# EAGLE design munia (EAGLE 8.2.2)

## Sheet 1 of 5: MCU
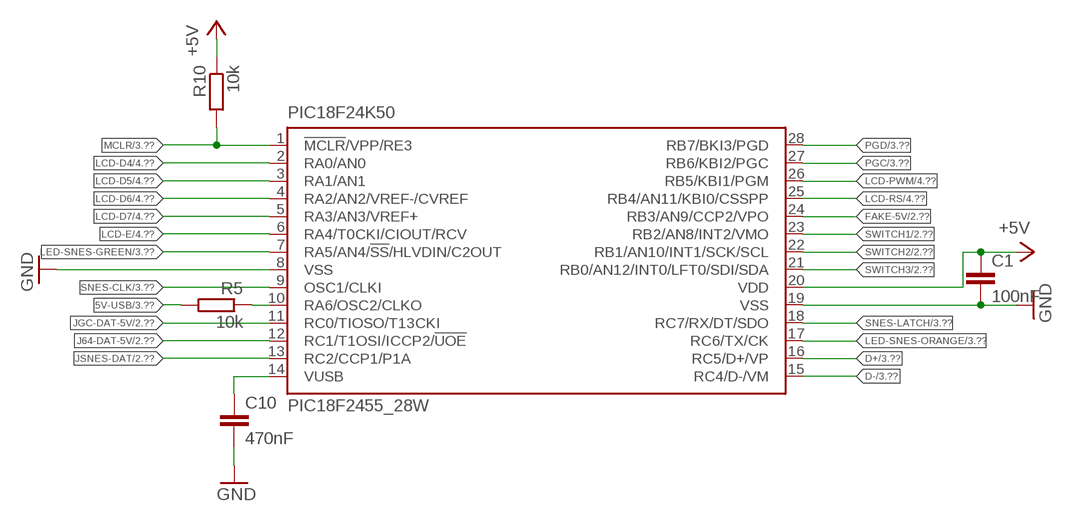
[diagram p0: schematic, sheet 1]

### Parts
C1  100nF  C-EUC0603  [C0603]
C10  470nF  C-EUC0603  [C0603]
PIC18F24K50  PIC18F2455_28W  [SO28W]
R5  10k  R-EU_R0603  [R0603]
R10  10k  R-EU_R0603  [R0603]

### Nets
5V-USB: R5.2 ; also sheet 3,5
+5V: C1.1 PIC18F24K50.20(VDD) R10.1 ; also sheet 2,3,4,5
D+: PIC18F24K50.16(RC5/D+/VP) ; also sheet 3
D-: PIC18F24K50.15(RC4/D-/VM) ; also sheet 3
FAKE-5V: PIC18F24K50.24(RB3/AN9/CCP2/VPO) ; also sheet 2
GND: C1.2 C10.2 PIC18F24K50.8(VSS) PIC18F24K50.19(VSS) ; also sheet 2,3,4,5
J64-DAT-5V: PIC18F24K50.12(RC1/T1OSI/ICCP2/!UOE) ; also sheet 2
JGC-DAT-5V: PIC18F24K50.11(RC0/TIOSO/T13CKI) ; also sheet 2
JSNES-DAT: PIC18F24K50.13(RC2/CCP1/P1A) ; also sheet 2,3
LCD-D4: PIC18F24K50.2(RA0/AN0) ; also sheet 4
LCD-D5: PIC18F24K50.3(RA1/AN1) ; also sheet 4
LCD-D6: PIC18F24K50.4(RA2/AN2/VREF-/CVREF) ; also sheet 4
LCD-D7: PIC18F24K50.5(RA3/AN3/VREF+) ; also sheet 4
LCD-E: PIC18F24K50.6(RA4/T0CKI/CIOUT/RCV) ; also sheet 4
LCD-PWM: PIC18F24K50.26(RB5/KBI1/PGM) ; also sheet 4
LCD-RS: PIC18F24K50.25(RB4/AN11/KBI0/CSSPP) ; also sheet 4
LED-SNES-GREEN: PIC18F24K50.7(RA5/AN4/!SS!/HLVDIN/C2OUT) ; also sheet 3
LED-SNES-ORANGE: PIC18F24K50.17(RC6/TX/CK) ; also sheet 3
MCLR: PIC18F24K50.1(!MCLR!/VPP/RE3) R10.2 ; also sheet 3
N$1: C10.1 PIC18F24K50.14(VUSB)
PGC: PIC18F24K50.27(RB6/KBI2/PGC) ; also sheet 3
PGD: PIC18F24K50.28(RB7/BKI3/PGD) ; also sheet 3
SNES-CLK: PIC18F24K50.9(OSC1/CLKI) ; also sheet 3
SNES-LATCH: PIC18F24K50.18(RC7/RX/DT/SDO) ; also sheet 3
SWITCH1: PIC18F24K50.23(RB2/AN8/INT2/VMO) ; also sheet 2
SWITCH2: PIC18F24K50.22(RB1/AN10/INT1/SCK/SCL) ; also sheet 2
SWITCH3: PIC18F24K50.21(RB0/AN12/INT0/LFT0/SDI/SDA) ; also sheet 2
USB-SENSE: PIC18F24K50.10(RA6/OSC2/CLKO) R5.1

## Sheet 2 of 5: SIGNALS
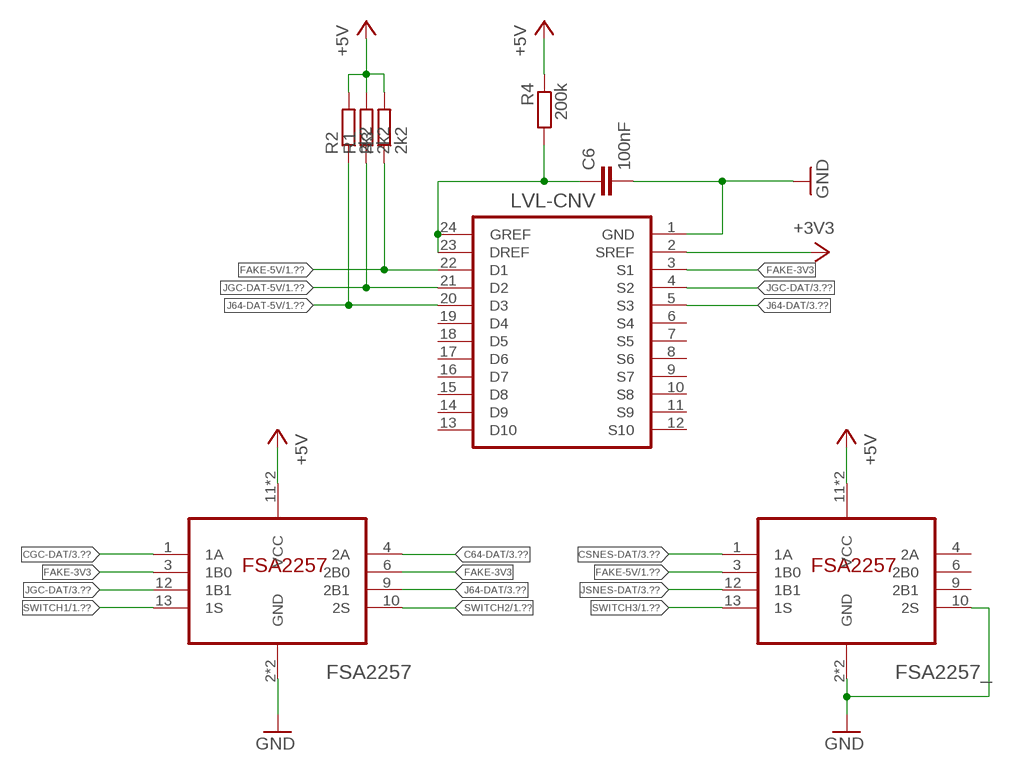
[diagram p1: schematic, sheet 2]

### Parts
C6  100nF  C-EUC0603  [C0603]
FSA2257  FSA2257MTCX  [TSSOP14]
FSA2257_  FSA2257MTCX  [TSSOP14]
LVL-CNV  GTL2010  [TSSOP24]
R1  2k2  R-EU_R0603  [R0603]
R2  2k2  R-EU_R0603  [R0603]
R3  2k2  R-EU_R0603  [R0603]
R4  200k  R-EU_R0603  [R0603]

### Nets
+3V3: LVL-CNV.2(SREF) ; also sheet 3,5
+5V: FSA2257.11(VCC) FSA2257.14(VCC) FSA2257_.11(VCC) FSA2257_.14(VCC) R1.2 R2.2 R3.2 R4.1 ; also sheet 1,3,4,5
C64-DAT: FSA2257.4(2A) ; also sheet 3
CGC-DAT: FSA2257.1(1A) ; also sheet 3
CSNES-DAT: FSA2257_.1(1A) ; also sheet 3
FAKE-3V3: FSA2257.3(1B0) FSA2257.6(2B0) LVL-CNV.3(S1)
FAKE-5V: FSA2257_.3(1B0) LVL-CNV.22(D1) R3.1 ; also sheet 1
GND: C6.2 FSA2257.2(GND) FSA2257.5(GND) FSA2257_.2(GND) FSA2257_.5(GND) FSA2257_.10(2S) LVL-CNV.1(GND) ; also sheet 1,3,4,5
J64-DAT: FSA2257.9(2B1) LVL-CNV.5(S3) ; also sheet 3
J64-DAT-5V: LVL-CNV.20(D3) R2.1 ; also sheet 1
JGC-DAT: FSA2257.12(1B1) LVL-CNV.4(S2) ; also sheet 3
JGC-DAT-5V: LVL-CNV.21(D2) R1.1 ; also sheet 1
JSNES-DAT: FSA2257_.12(1B1) ; also sheet 1,3
N$20: C6.1 LVL-CNV.23(DREF) LVL-CNV.24(GREF) R4.2
SWITCH1: FSA2257.13(1S) ; also sheet 1
SWITCH2: FSA2257.10(2S) ; also sheet 1
SWITCH3: FSA2257_.13(1S) ; also sheet 1
Unconnected: FSA2257_.4(2A) FSA2257_.6(2B0) FSA2257_.9(2B1) LVL-CNV.6(S4) LVL-CNV.7(S5) LVL-CNV.8(S6) LVL-CNV.9(S7) LVL-CNV.10(S8) LVL-CNV.11(S9) LVL-CNV.12(S10) LVL-CNV.13(D10) LVL-CNV.14(D9) LVL-CNV.15(D8) LVL-CNV.16(D7) LVL-CNV.17(D6) LVL-CNV.18(D5) LVL-CNV.19(D4)

## Sheet 3 of 5: CONNECTORS
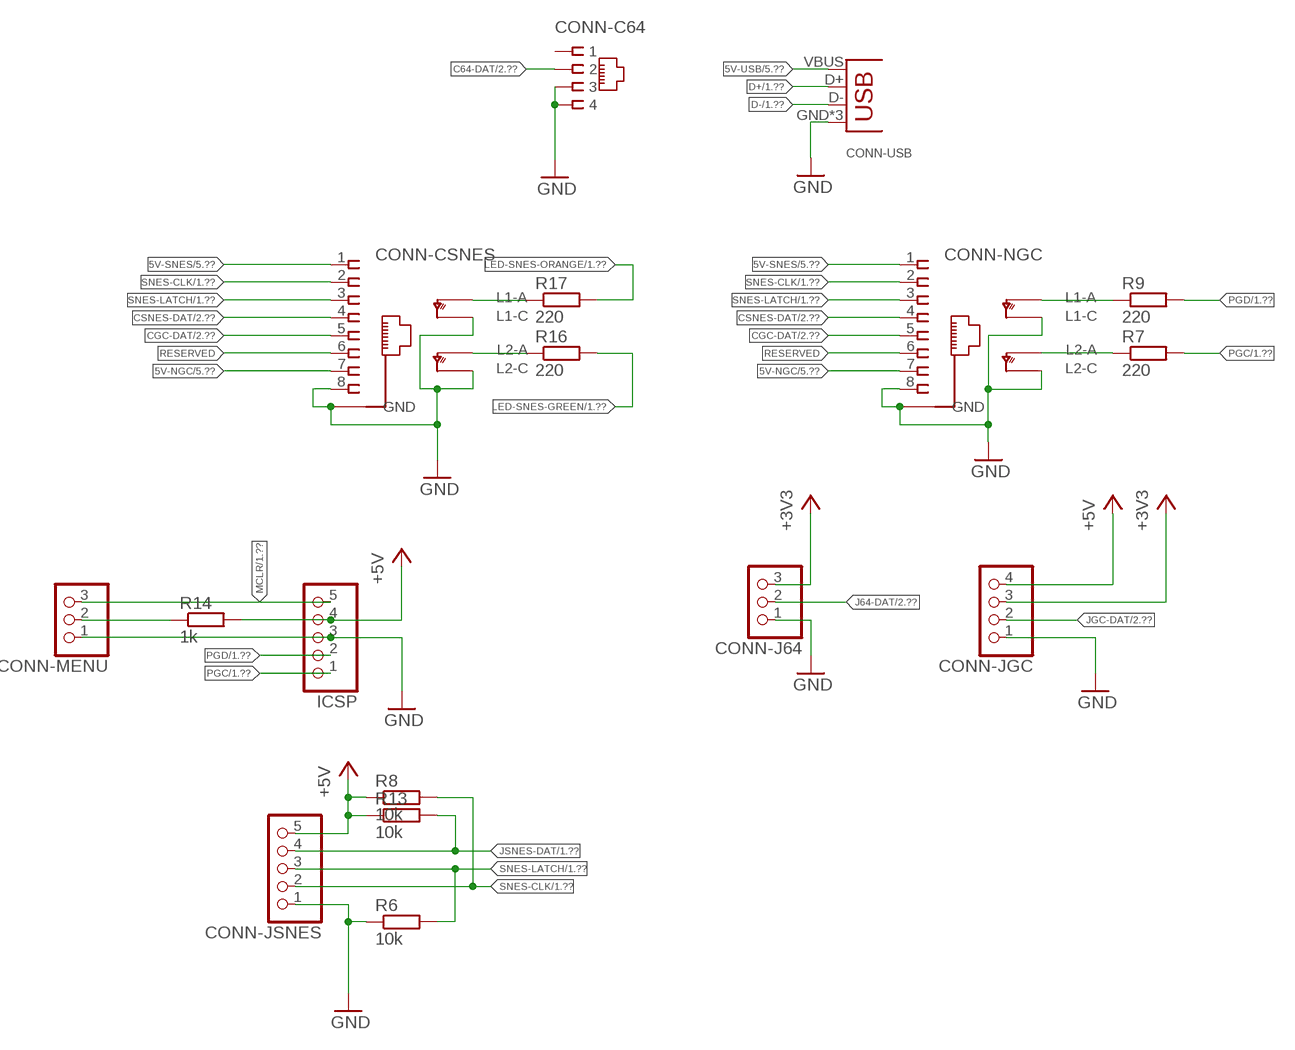
[diagram p2: schematic, sheet 3]

### Parts
CONN-C64  RJ11-6P4C  [RJ11-4C]
CONN-CSNES  RJ45-NIELS  [RJ45-NIELS]
CONN-J64  PINHD-1X3  [1X03]
CONN-JGC  PINHD-1X4  [1X04]
CONN-JSNES  PINHD-1X5  [1X05]
CONN-MENU  PINHD-1X3  [1X03]
CONN-NGC  RJ45-NIELS  [RJ45-NIELS]
CONN-USB  USB-B-NIELS  [USB-B-H]
ICSP  PINHD-1X5  [1X05]
R6  10k  R-EU_R0603  [R0603]
R7  220  R-EU_R0603  [R0603]
R8  10k  R-EU_R0603  [R0603]
R9  220  R-EU_R0603  [R0603]
R13  10k  R-EU_R0603  [R0603]
R14  1k  R-EU_R0603  [R0603]
R16  220  R-EU_R0603  [R0603]
R17  220  R-EU_R0603  [R0603]

### Nets
5V-NGC: CONN-CSNES.7 CONN-NGC.7 ; also sheet 5
5V-SNES: CONN-CSNES.1 CONN-NGC.1 ; also sheet 5
5V-USB: CONN-USB.VBUS ; also sheet 1,5
+3V3: CONN-J64.3 CONN-JGC.3 ; also sheet 2,5
+5V: CONN-JGC.4 CONN-JSNES.5 ICSP.4 R8.1 R13.1 R14.2 ; also sheet 1,2,4,5
C64-DAT: CONN-C64.2 ; also sheet 2
CGC-DAT: CONN-CSNES.5 CONN-NGC.5 ; also sheet 2
CSNES-DAT: CONN-CSNES.4 CONN-NGC.4 ; also sheet 2
D+: CONN-USB.D+ ; also sheet 1
D-: CONN-USB.D- ; also sheet 1
GND: CONN-C64.3 CONN-C64.4 CONN-CSNES.8 CONN-CSNES.GND@5(GND) CONN-CSNES.GND@6(GND) CONN-CSNES.LED-GREEN-C(L2C) CONN-CSNES.LED-ORANGE-C(L1C) CONN-J64.1 CONN-JGC.1 CONN-JSNES.1 CONN-MENU.1 CONN-NGC.8 CONN-NGC.GND@5(GND) CONN-NGC.GND@6(GND) CONN-NGC.LED-GREEN-C(L2C) CONN-NGC.LED-ORANGE-C(L1C) CONN-USB.GND CONN-USB.GND@1(GND) CONN-USB.GND@2(GND) ICSP.3 R6.1 ; also sheet 1,2,4,5
J64-DAT: CONN-J64.2 ; also sheet 2
JGC-DAT: CONN-JGC.2 ; also sheet 2
JSNES-DAT: CONN-JSNES.4 R13.2 ; also sheet 1,2
LED-SNES-GREEN: R16.2 ; also sheet 1
LED-SNES-ORANGE: R17.2 ; also sheet 1
MCLR: CONN-MENU.3 ICSP.5 ; also sheet 1
N$4: CONN-CSNES.LED-ORANGE-A(L1A) R17.1
N$5: CONN-CSNES.LED-GREEN-A(L2A) R16.1
N$8: CONN-NGC.LED-ORANGE-A(L1A) R9.1
N$23: CONN-NGC.LED-GREEN-A(L2A) R7.1
PGC: ICSP.1 R7.2 ; also sheet 1
PGD: ICSP.2 R9.2 ; also sheet 1
PWR-LED: CONN-MENU.2 R14.1
RESERVED: CONN-CSNES.6 CONN-NGC.6
SNES-CLK: CONN-CSNES.2 CONN-JSNES.2 CONN-NGC.2 R8.2 ; also sheet 1
SNES-LATCH: CONN-CSNES.3 CONN-JSNES.3 CONN-NGC.3 R6.2 ; also sheet 1
Unconnected: CONN-C64.1

## Sheet 4 of 5: LCD
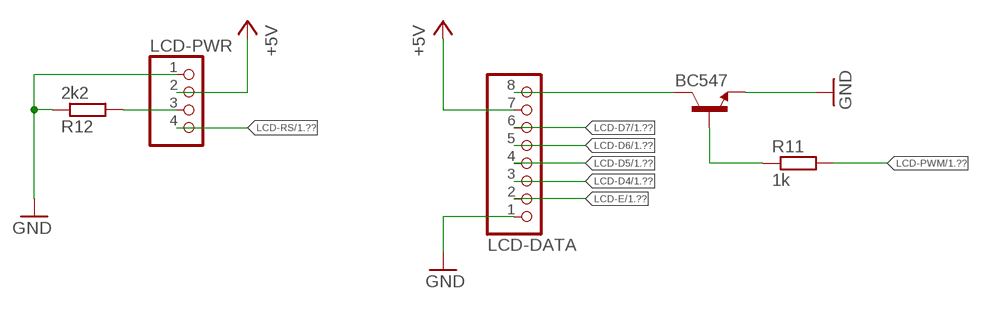
[diagram p3: schematic, sheet 4]

### Parts
BC547  BC847  [SOT23]
LCD-DATA  PINHD-1X8  [1X08]
LCD-PWR  PINHD-1X4  [1X04]
R11  1k  R-EU_R0603  [R0603]
R12  2k2  R-EU_R0603  [R0603]

### Nets
+5V: LCD-DATA.7 LCD-PWR.2 ; also sheet 1,2,3,5
C: BC547.3(C) LCD-DATA.8
GND: BC547.2(E) LCD-DATA.1 LCD-PWR.1 R12.1 ; also sheet 1,2,3,5
LCD-D4: LCD-DATA.3 ; also sheet 1
LCD-D5: LCD-DATA.4 ; also sheet 1
LCD-D6: LCD-DATA.5 ; also sheet 1
LCD-D7: LCD-DATA.6 ; also sheet 1
LCD-E: LCD-DATA.2 ; also sheet 1
LCD-PWM: R11.2 ; also sheet 1
LCD-RS: LCD-PWR.4 ; also sheet 1
N$19: BC547.1(B) R11.1
VEE: LCD-PWR.3 R12.2

## Sheet 5 of 5: POWER
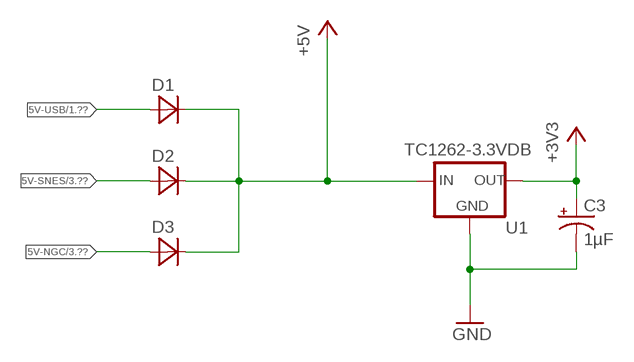
[diagram p4: schematic, sheet 5]

### Parts
C3  1µF  TANT-CAP1206  [EIA3216]
D1  MBR120VLSFT1G  [SOD123]
D2  MBR120VLSFT1G  [SOD123]
D3  MBR120VLSFT1G  [SOD123]
U1  TC1262-3.3VDB  [SOT230P700X180-4N]

### Nets
5V-NGC: D3.2(A) ; also sheet 3
5V-SNES: D2.2(A) ; also sheet 3
5V-USB: D1.2(A) ; also sheet 1,3
+3V3: C3.A(+) U1.3(OUT) ; also sheet 2,3
+5V: D1.1(C) D2.1(C) D3.1(C) U1.1(IN) ; also sheet 1,2,3,4
GND: C3.C(-) U1.2(GND) U1.4(GND) ; also sheet 1,2,3,4

## Library data of the parts
BC547 = transistor-neu-to92:BC847: NPN TRANSISTOR
C1 C6 C10 = resistor:C-EU: CAPACITOR, European symbol
C3 = Spark:TANT-CAP: Tantalum SMT
CONN-C64 = frank:RJ11-6P4C
CONN-CSNES CONN-NGC = frank:RJ45-NIELS
CONN-J64 CONN-MENU = pinhead:PINHD-1X3: PIN HEADER
CONN-JGC LCD-PWR = pinhead:PINHD-1X4: PIN HEADER
CONN-JSNES ICSP = pinhead:PINHD-1X5: PIN HEADER
CONN-USB = frank:USB: USB Connectors
D1-D3 = frank:MBR120VLSFT1G: DIODE, SCHOTTKY, 1A, 20V, SOD-123FL
FSA2257 FSA2257_ = frank:FSA2257MTCX
LCD-DATA = pinhead:PINHD-1X8: PIN HEADER
LVL-CNV = frank:GTL2010
PIC18F24K50 = microchip:PIC18F2*_28: USB Microcontrollers with nanoWatt Technology High-Performance, Enhanced Flash, 28/40/44-Pin, Source: http://ww1.microchip.com/downloads/en/devicedoc/39632c.pdf; MF: MICROCHIP; MPN: PIC18F2455-I/SO; OC_FARNELL: 1579598; OC_NEWARK: 64J3768
R1-R14 R16 R17 = resistor:R-EU_: RESISTOR, European symbol
U1 = frank:TC1262-3.3VDB: IC, 500mA Fixed Output CMOS LDO,3.3V,SOT-223, 3-lead; MPN: TC1262-3.3VDB; OC_FARNELL: 1852183; OC_NEWARK: 53R0370; PACKAGE: SOT-223-3; SUPPLIER: Microchip

## Net classes
0 default: width 0.152 mm, drill 0.25 mm, clearance 0.152 mm

## Board
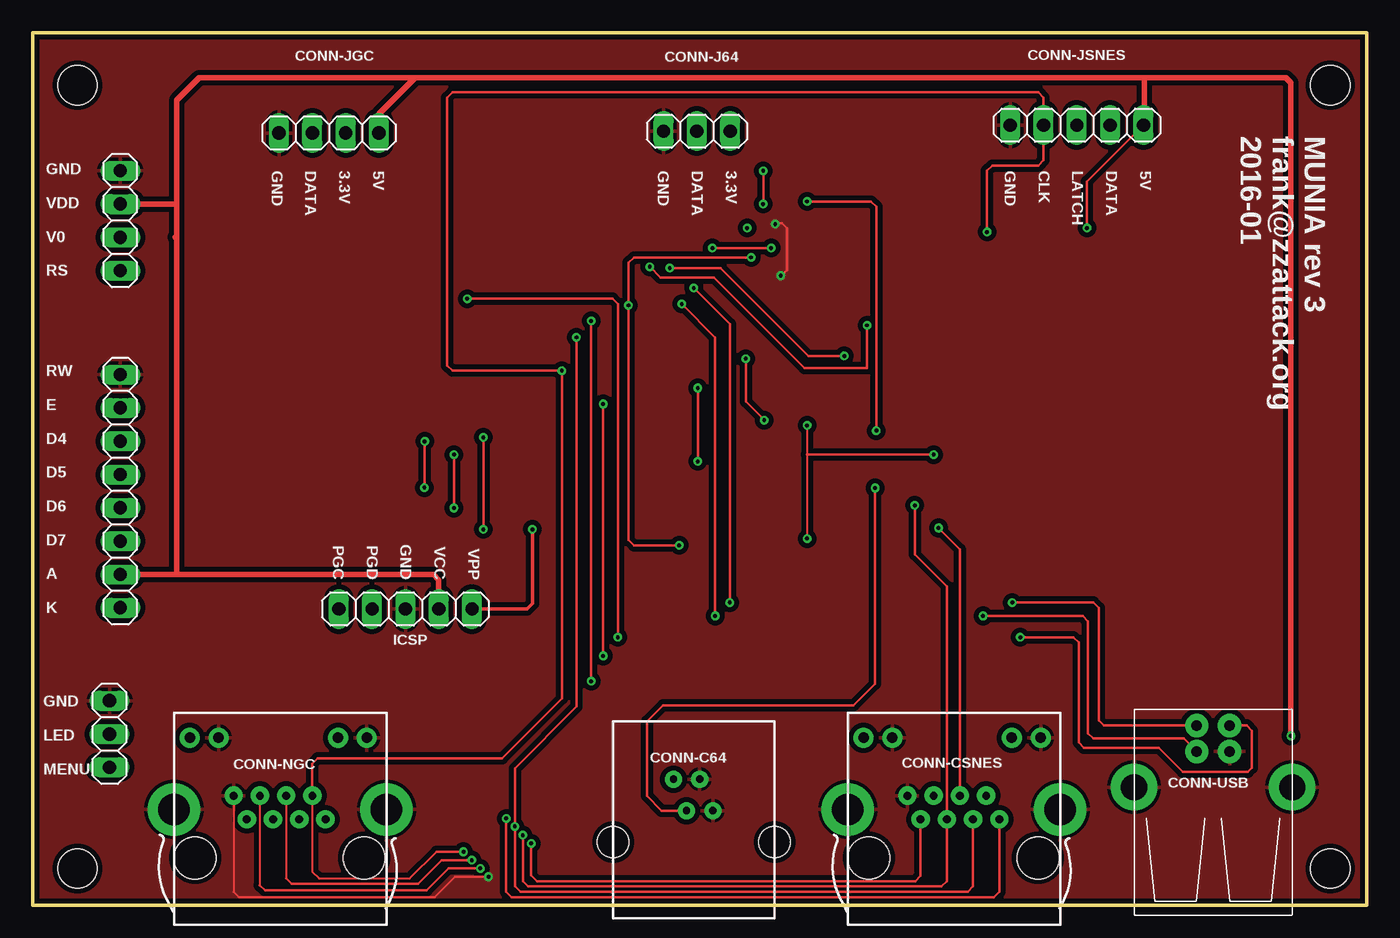
[diagram p5: board, top side]
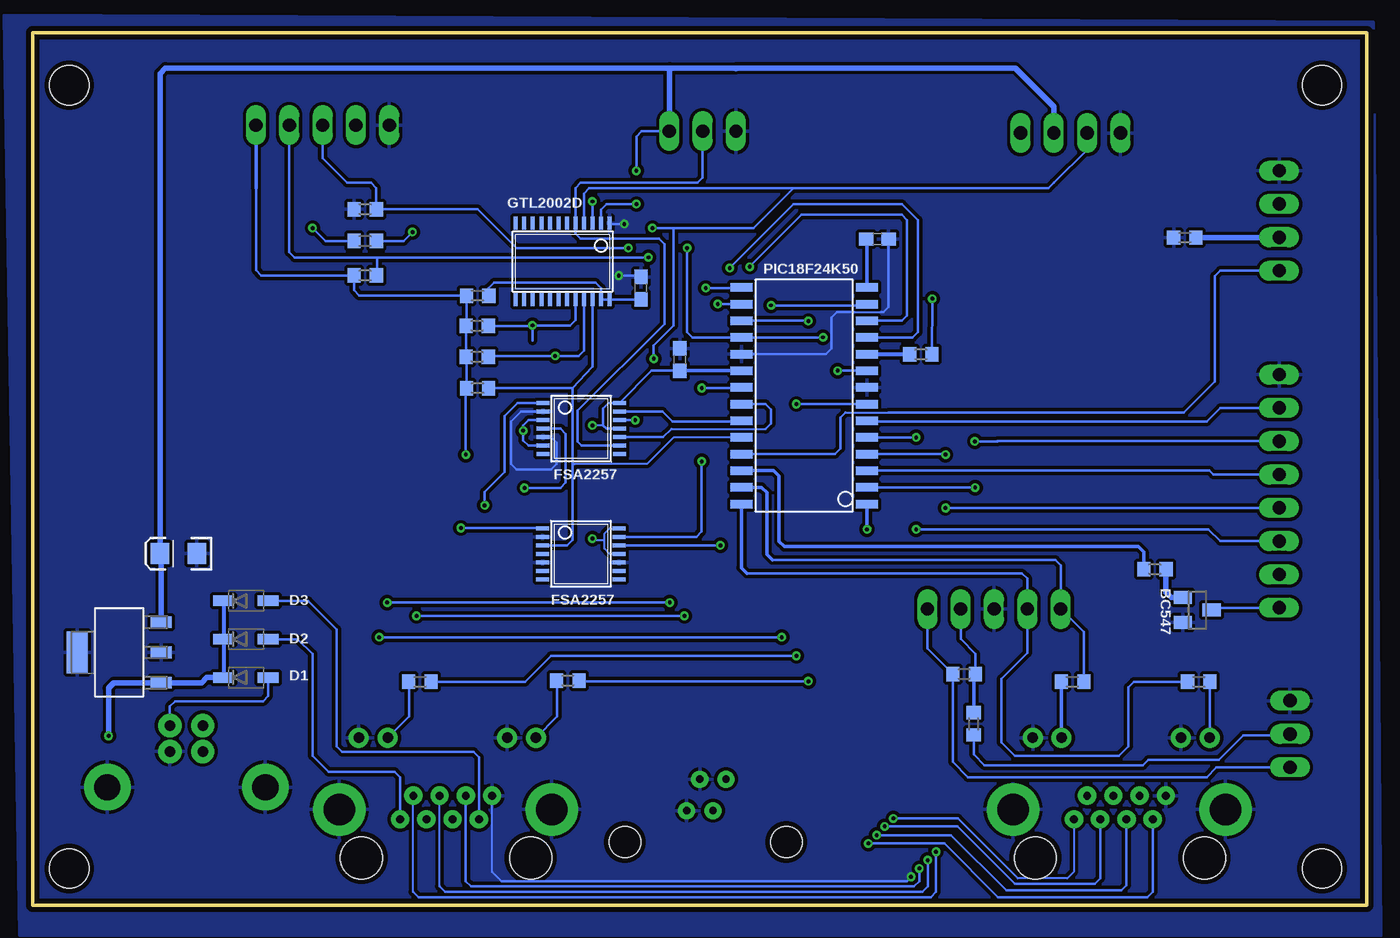
[diagram p6: board, bottom side, seen from below]

Size 101.67 x 66.5 mm. Coordinates in mm from the lower left corner, seen from the top.
Outline: 101.67,0 0,0 0,66.5 101.67,66.5 101.67,0
Copper layers (1*16): Top 0.0356mm / dielectric 1.5011mm / Bottom 0.0356mm
Design rules "pcbway 6mil 0.3mm drills *": minimum track width 6mil, minimum drill 0.3mm, track to track 6mil, track to pad 6mil, pad to pad 6mil, via to via 6mil, smd to smd 6mil, copper to edge 15mil, drill to drill 6mil, minimum pad ring 7mil, minimum via ring 7mil, stop-mask expansion 4mil, vias tented up to drill 999mil, thermal gap 10mil
Holes 3 mm at 3.4,62.5 3.4,2.77 98.9,62.5 98.9,2.77

### Footprints (pad centres in the part's own frame; a part is rotated, then mirrored left to right if it is on the bottom)
SOT23 = smd 1 x 1.4: 1 -0.95,-1.1; 2 0.95,-1.1; 3 0,1.1
C0603 = smd 1.1 x 1: 1 -0.85,0; 2 0.85,0
EIA3216 = smd 1.4 x 1.6: A 1.4,0; C -1.4,0
RJ11-4C = drill 0.55 pad 1.3: 1 4.6,10.6; 2 5.6,8.2; 3 6.6,10.6; 4 7.6,8.2 | hole 2.4: 0,5.8; 12.3,5.8
RJ45-NIELS = drill 0.6 pad 1.397: 1 11.55,8.05; 2 10.55,9.85; 3 9.55,8.05; 4 8.55,9.85; 5 7.55,8.05; 6 6.55,9.85; 7 5.55,8.05; 8 4.55,9.85 | drill 2.4 pad 4: GND@5 0,8.8; GND@6 16.2,8.8 | drill 0.8 pad 1.524: LED-GREEN-A 12.5,14.26; LED-GREEN-C 14.7,14.26; LED-ORANGE-A 1.2,14.26; LED-ORANGE-C 3.4,14.26 | hole 3.2: 1.6,5.1; 14.5,5.1
1X03 = drill 1.016 long: 1 -2.54,0; 2 0,0; 3 2.54,0
1X04 = drill 1.016 long: 1 -3.81,0; 2 -1.27,0; 3 1.27,0; 4 3.81,0
1X05 = drill 1.016 long: 1 -5.08,0; 2 -2.54,0; 3 0,0; 4 2.54,0; 5 5.08,0
USB-B-H = drill 0.8 pad 1.778: D+ 0,1.25; D- 1.981,1.25; GND 0,-1.25; VBUS 1.981,-1.25 | drill 2 pad 3.556: GND@1 -2.718,-6.02; GND@2 -2.718,6.02
SOD123 = smd 1.6 x 0.8: 1 -1.7,0; 2 1.7,0
TSSOP14 = smd 0.305 x 0.991: 1 -1.95,-2.918; 2 -1.3,-2.918; 3 -0.65,-2.918; 4 0,-2.918; 5 0.65,-2.918; 6 1.3,-2.918; 7 1.95,-2.918; 8 1.95,2.918; 9 1.3,2.918; 10 0.65,2.918; 11 0,2.918; 12 -0.65,2.918; 13 -1.3,2.918; 14 -1.95,2.918
1X08 = drill 1.016 long: 1 -8.89,0; 2 -6.35,0; 3 -3.81,0; 4 -1.27,0; 5 1.27,0; 6 3.81,0; 7 6.35,0; 8 8.89,0
TSSOP24 = smd 0.305 x 0.991: 1 -3.575,-2.918; 2 -2.925,-2.918; 3 -2.275,-2.918; 4 -1.625,-2.918; 5 -0.975,-2.918; 6 -0.325,-2.918; 7 0.325,-2.918; 8 0.975,-2.918; 9 1.625,-2.918; 10 2.275,-2.918; 11 2.925,-2.918; 12 3.575,-2.918; 13 3.575,2.918; 14 2.925,2.918; 15 2.275,2.918; 16 1.625,2.918; 17 0.975,2.918; 18 0.325,2.918; 19 -0.325,2.918; 20 -0.975,2.918; 21 -1.625,2.918; 22 -2.275,2.918; 23 -2.925,2.918; 24 -3.575,2.918
SO28W = smd 0.65 x 1.7: 1 -7.62,-4.78; 2 -6.35,-4.78; 3 -5.08,-4.78; 4 -3.81,-4.78; 5 -2.54,-4.78; 6 -1.27,-4.78; 7 0,-4.78; 8 1.27,-4.78; 9 2.54,-4.78; 10 3.81,-4.78; 11 5.08,-4.78; 12 6.35,-4.78; 13 7.62,-4.78; 14 8.89,-4.78; 15 8.89,4.78; 16 7.62,4.78; 17 6.35,4.78; 18 5.08,4.78; 19 3.81,4.78; 20 2.54,4.78; 21 1.27,4.78; 22 0,4.78; 23 -1.27,4.78; 24 -2.54,4.78; 25 -3.81,4.78; 26 -5.08,4.78; 27 -6.35,4.78; 28 -7.62,4.78
R0603 = smd 1 x 1.1: 1 -0.85,0; 2 0.85,0
SOT230P700X180-4N = smd 1.626 x 0.889: 1 -3.2,2.311; 2 -3.2,0; 3 -3.2,-2.311 | smd 1.626 x 3.175: 4 3.2,0

### Placement (x,y rotation side)
BC547  12.91,22.49 270 bottom
C1  52.36,41.58 90 bottom
C3  90.57,26.8 180 bottom
C6  55.32,47.03 90 bottom
C10  37.29,50.78 0 bottom
CONN-C64  44.24,-1 0 top
CONN-CSNES  62.12,-1.51 0 top
CONN-J64  50.62,59 0 top
CONN-JGC  22.58,58.86 0 top
CONN-JSNES  79.58,59.46 0 top
CONN-MENU  5.86,13.04 270 top
CONN-NGC  10.76,-1.51 0 top
CONN-USB  89.97,11.7 90 top
D1  85.42,17.35 0 bottom
D2  85.42,20.27 0 bottom
D3  85.42,23.19 0 bottom
FSA2257  59.88,36.32 270 bottom
FSA2257_  59.9,26.78 270 bottom
ICSP  28.4,22.58 0 top
LCD-DATA  6.67,31.55 270 top
LCD-PWR  6.67,52.17 270 top
LVL-CNV  61.29,49.06 180 bottom
PIC18F24K50  42.88,38.19 90 bottom
R1  67.8,41.8 180 bottom
R2  67.8,44.15 180 bottom
R3  67.77,39.41 180 bottom
R4  67.77,46.46 0 bottom
R5  33.99,41.98 0 bottom
R6  76.34,53.05 0 bottom
R7  22.42,17.02 0 bottom
R8  76.34,50.62 0 bottom
R9  12.8,17.02 180 bottom
R10  30.68,17.61 180 bottom
R11  16.14,25.61 180 bottom
R12  13.87,50.88 0 bottom
R13  76.34,48 0 bottom
R14  29.96,13.82 90 bottom
R16  72.17,17.02 0 bottom
R17  60.89,17.12 0 bottom
U1  95.08,19.27 180 bottom

### Tracks (layer width: path | path; a pad name or v marks a point on that pad's centre or on a via)
5V-NGC  (via drill 0.3)
  Top 0.203: CONN-CSNES.7 67.67,2.23 67.26,1.83 38.42,1.83 37.99,2.26 v37.99,4.7
  Bottom 0.203: CONN-NGC.7 16.31,1.02 16.72,0.61 28.11,0.61 32.19,4.7 v37.99,4.7 | 83.71,23.16 D3.2 80.67,23.19 78.51,21.03 78.51,12.09 78.1,11.68 68.08,11.68 67.67,11.28 CONN-CSNES.7
5V-SNES  (via drill 0.3)
  Top 0.203: v36.08,6.6 36.08,1.02 36.49,0.61 73.26,0.61 73.67,1.02 CONN-CSNES.1
  Bottom 0.152: CONN-NGC.1 22.31,2.54 22.82,2.03 26.61,2.03 31.18,6.6
  Bottom 0.203: v36.08,6.6 31.18,6.6 | D2.2 81.47,20.27 80.35,19.15 80.35,11.38 79.13,10.16 74.08,10.16 73.67,9.75 CONN-CSNES.1
5V-USB  (via drill 0.3)
  Top 0.203: v33.11,46.23 44.18,46.23 44.59,45.82 v44.59,20.42 | CONN-USB.VBUS 92.53,13.68 92.94,13.28 92.94,10.46 92.63,10.16 87.65,10.16 85.82,11.99 80.13,11.99 79.73,12.39 79.73,20.02 79.32,20.42 v75.27,20.42
  Bottom 0.203: R5.2 v33.11,46.23 | v44.59,20.42 v75.27,20.42 | CONN-USB.VBUS 91.22,15.14 90.82,15.54 84.12,15.54 83.72,15.95 D1.2
+3V3  (via drill 0.3, 0.3 pad 0.3)
  Top 0.203: v55.66,53.44 55.68,53.45 v55.68,55.98
  Bottom 0.203: U1.3 92.03,21.73 | 58.41,52.02 LVL-CNV.2 58.36,53.03 57.96,53.44 v55.66,53.44 | v55.68,55.98 55.66,55.99 55.66,58.59 55.26,59 CONN-J64.3
  Bottom 0.406: 48.04,63.8 26.79,63.8 23.85,60.86 CONN-JGC.3 | 48.08,63.77 48.04,63.8 | 92.03,21.73 91.98,21.78 92.02,21.82 | U1.3 91.88,26.7 C3.A 91.97,63.4 91.57,63.8 53.14,63.8 | 53.14,63.8 48.04,63.8 | 53.16,63.78 53.14,63.8 | CONN-J64.3 53.14,59.02 53.14,63.8
+5V  (via drill 0.3)
  Top 0.152: v59.02,36.58 59.02,34.34 v59.02,27.94
  Top 0.203: 59.02,34.34 v68.67,34.34 | v80.35,51.61 80.35,55.15 CONN-JSNES.5 84.72,59.52 | 10.86,53.45 10.96,53.54
  Top 0.406: 29.16,63.09 12.69,63.09 10.96,61.37 10.96,53.54 10.96,50.8 | 29.16,63.09 84.72,63.09 | v95.9,12.9 95.9,62.69 95.49,63.09 84.72,63.09 | 10.96,50.8 10.96,25.3 10.86,25.2 | 10.86,50.91 10.96,50.8 | LCD-DATA.7 10.86,25.2 | LCD-PWR.2 10.86,53.45 | ICSP.4 30.94,24.79 30.54,25.2 10.86,25.2 | 84.72,59.52 84.72,63.09 | CONN-JGC.4 26.39,60.32 29.16,63.09
  Bottom 0.152: FSA2257_.11 57.7,26.78 58.1,27.18 58.1,27.84 | 58.1,27.84 58.1,28.32 57.7,28.73 FSA2257_.14 | 58.2,36.58 v59.02,36.58 | v59.02,27.94 58.91,27.84 58.1,27.84
  Bottom 0.203: U1.1 | FSA2257.11 57.95,36.32 58.2,36.58 58.2,37.86 57.8,38.27 FSA2257.14 54.49,40.73 C1.1 | 68.62,44.18 R2.2 | R2.2 R1.2 68.62,41.57 R3.2 68.67,39.37 v68.67,34.34 | R2.2 68.62,44.19 R4.1 76.78,46.46 77.19,46.87 R13.1 84.25,48 84.66,48.41 84.66,54.67 | R8.1 79.36,50.62 v80.35,51.61 | R10.1 29.83,19.16 30.94,20.27 ICSP.4
  Bottom 0.254: 84.66,54.67 CONN-JSNES.5 | R14.2 29.96,17.48 R10.1 | 47.69,40.71 PIC18F24K50.20 C1.1
  Bottom 0.305: D3.1 87.14,20.29 D2.1 D1.1
  Bottom 0.406: U1.1 95.49,16.96 95.9,16.55 v95.9,12.9 | U1.1 88.8,16.95 88.41,17.35 D1.1
C
  Bottom 0.203: LCD-DATA.8 11.65,22.66 arc-90 BC547.3
C64-DAT  (via drill 0.3)
  Top 0.203: v64.2,31.8 64.2,16.88 62.56,15.24 48.03,15.24 46.81,14.02 46.81,8.33 47.94,7.2 CONN-C64.2
  Bottom 0.203: FSA2257.4 61.45,36.32 61.05,35.91 61.05,32.21 61.45,31.8 v64.2,31.8
CGC-DAT  (via drill 0.3)
  Top 0.203: v37.35,5.33 37.35,1.83 37.76,1.42 69.26,1.42 69.67,1.83 CONN-CSNES.5 69.67,24.28 67.23,26.72 v67.23,30.48
  Bottom 0.203: CONN-NGC.5 18.31,1.52 18.72,1.12 27.47,1.12 31.69,5.33 v37.35,5.33 | FSA2257.1 64.74,38.27 65.72,37.29 65.72,33.01 67.23,31.5 v67.23,30.48
CSNES-DAT  (via drill 0.3)
  Top 0.152: CONN-NGC.4 19.31,2.03
  Top 0.203: 19.31,2.03 19.72,1.63 29.38,1.63 31.18,3.43 v33.46,3.43 | CONN-CSNES.4 70.67,27.13 v69.05,28.75
  Bottom 0.152: 70.67,1.42 CONN-CSNES.4
  Bottom 0.203: v33.46,3.43 33.46,1.42 33.87,1.02 70.26,1.02 70.67,1.42 | FSA2257_.1 62.84,28.75 v69.05,28.75
D+  (via drill 0.3)
  Top 0.203: v49.47,45.82 52.01,43.28 v52.01,22.05 | v72.43,22.05 80.03,22.05 80.44,21.64 80.44,13.11 80.84,12.7 87.72,12.7 CONN-USB.D+
  Bottom 0.203: v72.43,22.05 v52.01,22.05 | PIC18F24K50.16 47.67,45.82 v49.47,45.82
D-  (via drill 0.3)
  Top 0.203: v53.12,23.06 53.12,44.3 v50.38,47.04 | CONN-USB.D- 81.66,13.68 81.25,14.09 81.25,22.66 80.84,23.06 v74.66,23.06
  Bottom 0.203: v74.66,23.06 v53.12,23.06 | v50.38,47.04 47.7,47.04 PIC18F24K50.15
FAKE-3V3  (via drill 0.3)
  Top 0.203: v64.3,36.17 64.3,53.24 63.89,53.65 v59.02,53.65
  Bottom 0.203: v59.02,53.65 LVL-CNV.3 | FSA2257.6 63.89,35.02 64.3,35.43 v64.3,36.17 64.3,36.56 63.89,36.97 FSA2257.3
FAKE-5V
  Bottom 0.152: PIC18F24K50.24 52.83,35.65 54.85,33.63 60.37,33.63
  Bottom 0.203: 64.61,39.42 64.1,39.42 | 64.1,39.42 60.54,39.42 | FSA2257_.3 60.95,27.43 60.54,27.83 60.54,33.63 | 60.54,33.63 60.54,39.42 | 60.37,33.63 60.54,33.63 | R3.1 64.11,39.41 64.1,39.42 | LVL-CNV.22 59.01,41.05 60.54,39.42
GND  (via drill 0.3, 0.3 pad 0.3)
  Top 0.152: CONN-NGC.8 15.31,1.02
  Top 0.203: 15.31,1.02 15.72,0.61 30.64,0.61 32.19,2.16 v34.73,2.16 | v57.01,47.99 57.09,47.99 57.5,48.4 57.5,51.59 57.09,52 56.5,52
  Bottom 0.152: 66.67,2.54 CONN-CSNES.8 | 39.05,45.19 36.98,45.19 | 36.51,50.64 C10.2 | 47.62,42.07 PIC18F24K50.19 | 55.5,48 C6.2
  Bottom 0.203: 55.41,47.94 C6.2 | 66.67,2.54 65.96,1.83 35.06,1.83 v34.73,2.16 | FSA2257.5 62.17,35.67 61.76,35.26 61.76,33.63 62.17,33.22 64.81,33.22 65.21,33.63 65.21,36.88 64.47,37.62 FSA2257.2 | PIC18F24K50.19 41.2,42 40.8,42.41 40.8,44.79 40.39,45.19 39.05,45.19 | C10.2 36.44,45.6 36.85,45.19 36.98,45.19 | LVL-CNV.1 57.65,51.92 v56.59,51.92 | 55.5,48 55.51,47.99 v57.01,47.99
  pour Bottom (isolate 0.254): -1.09,-2.34 -0.49,67.31 103.86,67.83 102.66,-2.3
  pour Top (isolate 0.381): -0.97,-0.92 -1.27,69.04 105.42,68.42 103.76,-1.76
J64-DAT
  Bottom 0.152: 56.93,35.05 FSA2257.9
  Bottom 0.203: CONN-J64.2 50.62,55.47 51.03,55.07 59.91,55.07 60.31,54.66 LVL-CNV.5 60.31,51.21 59.91,50.8 53.94,50.8 53.53,50.39 53.53,44.3 60.13,37.69 60.13,35.36 59.83,35.05 56.93,35.05
J64-DAT-5V  (via drill 0.3)
  Top 0.203: v47.03,48.67 47.84,47.85 51.91,47.85 58.81,40.95 63.59,40.95 v63.59,44.2
  Bottom 0.203: PIC18F24K50.12 35.45,44.54 35.04,44.95 35.04,52.22 35.45,52.63 43.07,52.63 v47.03,48.67 | v63.59,44.2 63.59,43.04 | LVL-CNV.20 60.31,44.6 60.72,44.2 v63.59,44.2 | v63.59,44.2 63.63,44.15 R2.1
JGC-DAT  (via drill 0.3)
  Top 0.203: v55.75,36.97 54.34,38.38 v54.34,41.66
  Bottom 0.152: 23.85,55.07 21.31,57.61 CONN-JGC.2
  Bottom 0.203: LVL-CNV.4 59.66,54.25 59.26,54.66 43.69,54.66 | FSA2257.12 v55.75,36.97 | v54.34,41.66 54.34,42.67 52.82,44.2 52.82,51.21 52.83,51.22 52.83,51.61 | 53.23,51.61 v54.45,51.61 52.83,51.61 | 52.83,51.61 46.74,51.61 43.69,54.66 | 23.85,55.07 24.25,54.66 43.69,54.66
JGC-DAT-5V  (via drill 0.3)
  Top 0.203: v48.55,48.56 52.41,48.56 59.12,41.86 v61.86,41.86
  Bottom 0.203: LVL-CNV.21 59.66,42.27 60.07,41.86 v61.86,41.86 66.89,41.86 R1.1 | PIC18F24K50.11 34.63,43.27 34.23,43.68 34.23,52.22 35.45,53.44 43.67,53.44 v48.55,48.56
JSNES-DAT  (via drill 0.3)
  Top 0.203: v49.26,27.43 45.81,27.43 45.4,27.84 v45.4,45.72 45.4,48.97 45.81,49.38 v54.75,49.38
  Bottom 0.203: CONN-JSNES.4 82.12,49.78 81.71,49.38 75.43,49.38 | FSA2257_.12 v49.26,27.43 | v45.4,45.72 38.19,45.72 PIC18F24K50.13 | 75.43,49.38 v54.75,49.38 | R13.2 75.43,48.06 75.43,49.38
LCD-D4  (via drill 0.3)
  Top 0.203: v29.84,31.83 29.87,31.85 v29.87,35.36
  Bottom 0.203: LCD-DATA.3 28.13,35.36 28.14,35.36 v29.87,35.36 | v29.84,31.83 29.86,31.84 PIC18F24K50.2
LCD-D5
  Bottom 0.203: LCD-DATA.4 11.69,32.82 11.98,33.11 PIC18F24K50.3
LCD-D6  (via drill 0.3)
  Top 0.203: v32.11,34.34 v32.11,30.28
  Bottom 0.203: LCD-DATA.5 25.59,30.28 v32.11,30.28 | PIC18F24K50.4 32.15,34.38 v32.11,34.34
LCD-D7  (via drill 0.3)
  Top 0.203: v34.34,35.66 v34.34,28.65
  Bottom 0.203: LCD-DATA.6 11.17,27.74 12.08,28.65 v34.34,28.65 | PIC18F24K50.5 38.09,35.66 v34.34,35.66
LCD-E
  Bottom 0.203: PIC18F24K50.6 38.06,36.88 12.19,36.88 11.17,37.9 LCD-DATA.2
LCD-PWM
  Bottom 0.254: PIC18F24K50.26 45.2,33.11 44.79,32.71 44.79,27.74 44.39,27.33 17.4,27.33 17,26.92 R11.2
LCD-RS
  Bottom 0.152: 39.71,37.57 36.46,37.57
  Bottom 0.203: PIC18F24K50.25 40.53,34.38 40.12,34.79 40.12,37.16 39.71,37.57 | 36.46,37.57 13.95,37.57 11.58,39.93 11.58,47.96 11.18,48.37 LCD-PWR.4
LED-SNES-GREEN  (via drill 0.3)
  Top 0.203: v43.47,38.2 v43.47,19
  Bottom 0.203: R16.2 64.15,17.02 62.17,19 v43.47,19 | PIC18F24K50.7 v43.46,38.19 v43.47,38.2
LED-SNES-ORANGE  (via drill 0.3)
  Top 0.203: v42.56,44.53 v42.56,17.07
  Bottom 0.203: R17.2 59.99,17.07 v42.56,17.07 | 47.64,44.53 PIC18F24K50.17 42.58,44.54 v42.56,44.53
MCLR  (via drill 0.3)
  Top 0.254: v38.09,28.65 38.09,22.98 37.68,22.58 ICSP.5
  Bottom 0.203: ICSP.5 33.48,19.56 R10.2 31.53,10.91 30.38,9.75 12.19,9.75 11.45,10.5 CONN-MENU.3
  Bottom 0.254: PIC18F24K50.1 38.09,30.56 v38.09,28.65
N$1
  Bottom 0.254: C10.1 38.1,50.73 PIC18F24K50.14
N$4
  Bottom 0.203: R17.1 61.7,17.07 61.7,14.38 CONN-CSNES.LED-ORANGE-A
N$5
  Bottom 0.203: R16.1 73,16.93 73,14.38 CONN-CSNES.LED-GREEN-A
N$8
  Bottom 0.203: R9.1 CONN-NGC.LED-ORANGE-A
N$19
  Bottom 0.406: BC547.1 14.89,23.44 15.29,23.85 R11.1
N$20
  Bottom 0.203: C6.1 55.36,46.15 LVL-CNV.24 LVL-CNV.23 58.36,47.04 58.77,47.45 66.51,47.45 66.92,47.04 R4.2
N$23
  Bottom 0.203: R7.1 23.34,16.83 23.26,16.83
  Bottom 0.254: 23.26,16.96 23.26,16.83 CONN-NGC.LED-GREEN-A
PGC
  Bottom 0.203: 45.3,26.31 23.73,26.31 23.32,25.91 ICSP.1 21.57,20.83 R7.2
  Bottom 0.254: 45.3,26.31 45.71,26.72 45.71,31.44 46.11,31.84 PIC18F24K50.27
PGD
  Bottom 0.203: R9.2 17.77,17.02 18.17,16.61 18.17,12.09 18.89,11.38 26.82,11.38 27.84,12.39 27.84,17.26 25.86,19.23 ICSP.2 25.86,24.89 26.27,25.3 47.25,25.3
  Bottom 0.254: PIC18F24K50.28 47.66,25.7 47.25,25.3
PWR-LED
  Bottom 0.203: R14.1 29.96,11.48 29.15,10.67 17.07,10.67 16.66,11.07 11.28,11.07 9.41,12.94 6.46,12.94 CONN-MENU.2
RESERVED  (via drill 0.3)
  Top 0.152: CONN-NGC.6 17.31,1.52
  Top 0.203: 17.31,1.52 17.72,1.12 30.01,1.12 31.69,2.79 v34.1,2.79
  Bottom 0.203: v34.1,2.79 34.1,1.83 34.51,1.42 68.26,1.42 68.67,1.83 CONN-CSNES.6
SNES-CLK  (via drill 0.3)
  Top 0.152: CONN-NGC.2 21.31,2.54 21.82,2.03 28.74,2.03 30.77,4.06
  Top 0.203: 30.77,4.06 v32.83,4.06 | CONN-NGC.2 21.31,10.77 21.72,11.18 35.75,11.18 40.32,15.75 v40.32,40.74 32,40.74 31.6,41.15 31.6,61.57 32,61.98 76.63,61.98 77.04,61.57 CONN-JSNES.2 77.04,56.79 76.63,56.39 73.14,56.39 72.73,55.98 v72.73,51.31
  Bottom 0.152: 72.67,1.02 CONN-CSNES.2
  Bottom 0.203: v32.83,4.06 32.83,1.02 33.24,0.61 72.26,0.61 72.67,1.02 | v40.32,40.74 38.11,40.74 PIC18F24K50.9 | 75.49,51.02 R8.2 73.42,50.62 v72.73,51.31
SNES-LATCH  (via drill 0.3)
  Top 0.203: CONN-CSNES.3 71.67,1.42 71.26,1.02 37.17,1.02 36.74,1.45 v36.74,5.99 36.74,10.44 41.44,15.14 v41.44,43.28 | v56.27,50.09 v51.8,50.09
  Bottom 0.203: CONN-NGC.3 20.31,2.03 20.72,1.63 26.84,1.63 31.2,5.99 v36.74,5.99 | v41.44,43.28 47.65,43.28 PIC18F24K50.18 51.4,43.27 51.8,43.68 v51.8,50.09 | v56.27,50.09 64.8,50.09 67.75,53.05 R6.2 75.49,54.66 75.9,55.07 77.71,55.07 79.58,56.94 CONN-JSNES.3
SWITCH1
  Bottom 0.203: FSA2257.13 53.66,37.62 52.92,36.88 47.7,36.88 PIC18F24K50.23
SWITCH2
  Bottom 0.152: 53,36.3 45.81,36.3
  Bottom 0.203: FSA2257.10 53.62,35.67 53,36.3 | PIC18F24K50.22 45.81,38.19 45.4,37.79 45.4,36.7 45.81,36.3
SWITCH3  (via drill 0.3)
  Top 0.203: v50.69,39.42 v50.69,33.83
  Bottom 0.203: PIC18F24K50.21 47.7,39.42 v50.69,39.42 | v50.69,33.83 50.69,28.48 51.09,28.08 FSA2257_.13
USB-SENSE
  Bottom 0.305: R5.1 38.07,41.98 PIC18F24K50.10
VEE
  Bottom 0.406: R12.2 8.15,50.88 LCD-PWR.3

### Text on the board
tNames: MUNIA rev 3 / frank@zzattack.org / 2016-01 | 5V / / 3.3V / / DATA / / GND | 3.3V / / DATA / / GND | 5V / / DATA / / LATCH / / CLK / / GND | GND / / VDD / / V0 / / RS | VPP / / VCC / / GND / / PGD / / PGC | RW / / E / / D4 / / D5 / / D6 / / D7 / / A / / K | GND / / LED / / MENU
bNames: GTL2002D | FSA2257 | FSA2257